# Altium schematic sheet 220V_Control.SchDoc
size A4
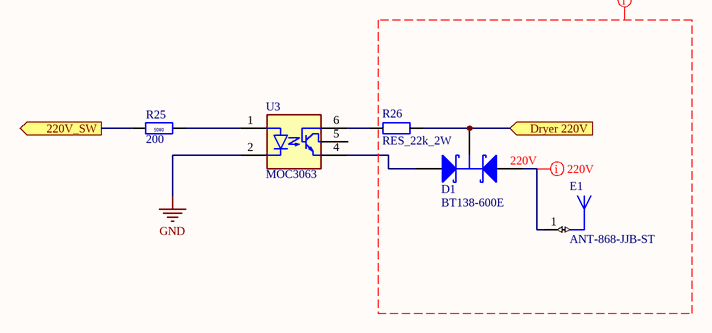
[diagram p0: 220V_Control.SchDoc]

## Parts
D1  BT138-600E  [TO-220]
E1  ANT-868-JJB-ST  [ANT-XXX-JJB-ST]
R25  value 200  [RESC2012-0805M]  (hidden comment: RESC_0805_R)
R26  RES_22k_2W  [PCBComponent_1]
U3  MOC3063  [DIP6-400]

## Ports
220V_SW (out), Dryer 220V (in)

## Nets
GND: U3.2
220V_SW: R25.2 ; port 220V_SW
Dryer 220V: D1.2(K) R26.2 ; port Dryer 220V
NetD1_1: D1.1(A1) E1.1(FEED)
NetD1_3: D1.3(A2) U3.4
NetR25_1: R25.1 U3.1
NetR26_1: R26.1 U3.6

Not connected (* = marked no-connect by the designer): U3 3 5

## Layout directives
mark named HG: (no net found under the mark)
net class 220V: NetD1_1

## Notes on the sheet
- (near D1) 220V
- (in symbol RESC_0805_R) 0805

## Library data of the parts
D1 = MBR20xx: Schottky Rectifier 20 A TO-220; Note: Pin 2 (cathode) is electrically connected to TAB; Published: 8-Jun-2000; LatestRevisionDate: 17-Jul-2002; LatestRevisionNote: Re-released for DXP Platform.; DatasheetVersion: Dec-1997; PackageVersion: Feb-1997; PackageReference: TO-220AB; Publisher: Altium Limited; PackageDescription: TO, Thru-Hole, Vertical, Heatsink Mounted; 3 In-Line Leads; Pitch 2.54 mm; ComponentLink1Description: Manufacturer Link; ComponentLink1URL: http://www.irf.com/; ComponentLink2Description: Datasheet; ComponentLink2URL: http://www.irf.com/product-info/datasheets/data/mbr2035ct.pdf
E1 = ANT-868-JJB-ST: Embeddable 1/4-wave Monopole Antenna, JJB Series, 868MHz, 7mm Dia. Package, Straight; DatasheetVersion: 22/07/2008; PackageVersion: 22/07/2008; PackageReference: ANT-XXX-JJB-ST; PackageDescription: Antenna, Monopole, JJB Series, Thru-Hole, Straight, 7.0 x 9.0 mm (Dia.xH typ); ComponentLink1Description: Manufacturer URL; ComponentLink1URL: http://www.linxtechnologies.com/; ComponentLink2Description: Datasheet; ComponentLink2URL: http://www.antennafactor.com/documents/ANT-868-JJB-xx_Data_Sheet.pdf
R25 = RESC_0805_R: Resistor 0805
R26 = RES_22k_2W: Резистор 2 Вт
U3 = CNY17: CNY17 phototransistor optoclupler